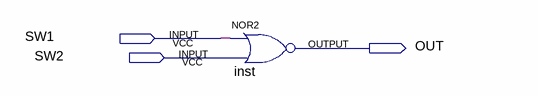
[diagram p0: schematic sheet]
// Quartus schematic Block1.bdf as structural Verilog: 1 symbols, 3 pins
module Block1 (
  input  SW1,
  input  SW2,
  output OUT
);

  nor inst (OUT, SW1, SW2);
endmodule
